# Altium schematic sheet FPGA核心板01.SchDoc
size A3
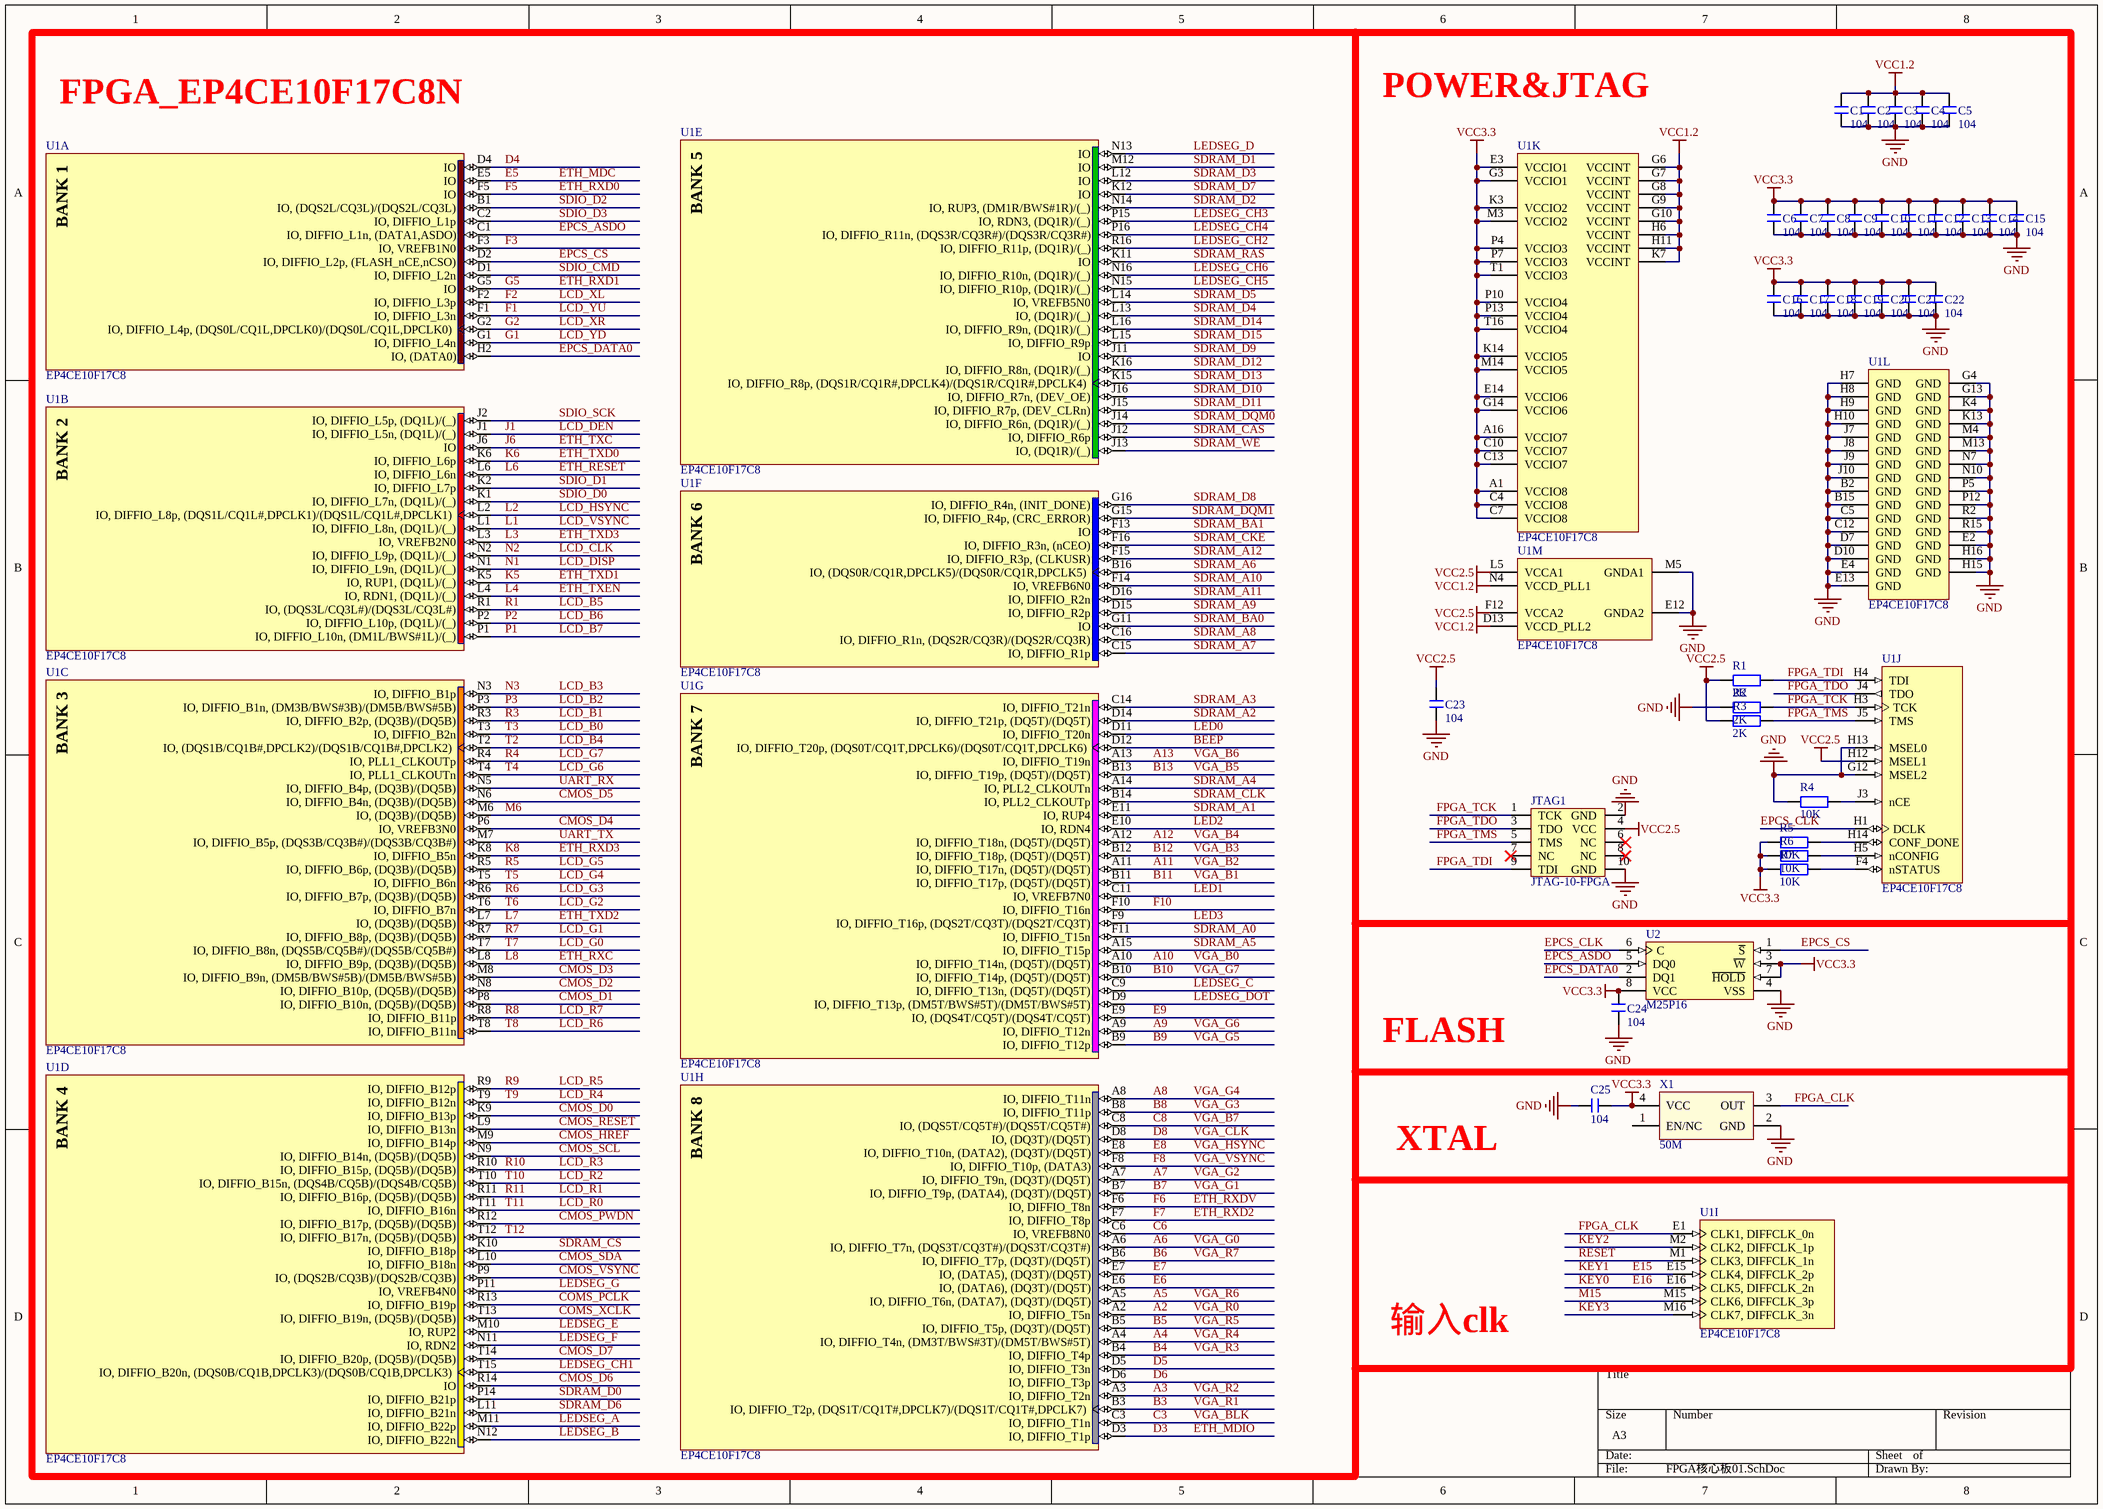
[diagram p0: FPGA核心板01.SchDoc]

## Parts
C1  104  [C 0603_L]
C2  104  [C 0603_L]
C3  104  [C 0603_L]
C4  104  [C 0603_L]
C5  104  [C 0603_L]
C6  104  [C 0603_L]
C7  104  [C 0603_L]
C8  104  [C 0603_L]
C9  104  [C 0603_L]
C10  104  [C 0603_L]
C11  104  [C 0603_L]
C12  104  [C 0603_L]
C13  104  [C 0603_L]
C14  104  [C 0603_L]
C15  104  [C 0603_L]
C16  104  [C 0603_L]
C17  104  [C 0603_L]
C18  104  [C 0603_L]
C19  104  [C 0603_L]
C20  104  [C 0603_L]
C21  104  [C 0603_L]
C22  104  [C 0603_L]
C23  104  [C 0603_L]
C24  104  [C 0603_L]
C25  104  [C 0603_L]
JTAG1  JTAG-10-FPGA  [JTAG_10_2.54]
R1  2K  [R 0603_L]
R2  2K  [R 0603_L]
R3  2K  [R 0603_L]
R4  10K  [R 0603_L]
R5  10K  [R 0603_L]
R6  10K  [R 0603_L]
R7  10K  [R 0603_L]
U1  EP4CE10F17C8  [FBGA256]  (parts A,B,C,D,E,F,G,H,I,J,K,L,M of 13)
U2  M25P16  [sop-8]
X1  50M  [OSC 3225-4P]

## Nets
GND: C1.1 C2.1 C3.1 C4.1 C5.1 C6.1 C7.1 C8.1 C9.1 C10.1 C11.1 C12.1 C13.1 C14.1 C15.1 C16.1 C17.1 C18.1 C19.1 C20.1 C21.1 C22.1 C23.1 C24.1 C25.2 JTAG1.2(GND) JTAG1.10(GND) R2.1 R4.1 U1.B2(GND) U1.B15(GND) U1.C5(GND) U1.C12(GND) U1.D7(GND) U1.D10(GND) U1.E2(GND) U1.E4(GND) U1.E12(GNDA2) U1.E13(GND) U1.G4(GND) U1.G12(MSEL2) U1.G13(GND) U1.H7(GND) U1.H8(GND) U1.H9(GND) U1.H10(GND) U1.H13(MSEL0) U1.H15(GND) U1.H16(GND) U1.J7(GND) U1.J8(GND) U1.J9(GND) U1.J10(GND) U1.K4(GND) U1.K13(GND) U1.M4(GND) U1.M5(GNDA1) U1.M13(GND) U1.N7(GND) U1.N10(GND) U1.P5(GND) U1.P12(GND) U1.R2(GND) U1.R15(GND) U2.4(VSS) X1.2(GND)
VCC1.2: C1.2 C2.2 C3.2 C4.2 C5.2 U1.D13(VCCD_PLL2) U1.G6(VCCINT) U1.G7(VCCINT) U1.G8(VCCINT) U1.G9(VCCINT) U1.G10(VCCINT) U1.H6(VCCINT) U1.H11(VCCINT) U1.K7(VCCINT) U1.N4(VCCD_PLL1)
VCC2.5: C23.2 JTAG1.4(VCC) R1.1 R3.1 U1.F12(VCCA2) U1.H12(MSEL1) U1.L5(VCCA1)
VCC3.3: C6.2 C7.2 C8.2 C9.2 C10.2 C11.2 C12.2 C13.2 C14.2 C15.2 C16.2 C17.2 C18.2 C19.2 C20.2 C21.2 C22.2 C24.2 C25.1 R5.1 R6.1 R7.1 U1.A1(VCCIO8) U1.A16(VCCIO7) U1.C4(VCCIO8) U1.C7(VCCIO8) U1.C10(VCCIO7) U1.C13(VCCIO7) U1.E3(VCCIO1) U1.E14(VCCIO6) U1.G3(VCCIO1) U1.G14(VCCIO6) U1.K3(VCCIO2) U1.K14(VCCIO5) U1.M3(VCCIO2) U1.M14(VCCIO5) U1.P4(VCCIO3) U1.P7(VCCIO3) U1.P10(VCCIO4) U1.P13(VCCIO4) U1.T1(VCCIO3) U1.T16(VCCIO4) U2.3(~{W}) U2.7(~{HOLD}) U2.8(VCC) X1.4(VCC)
A2: U1.A2(IO,_DIFFIO_T5n)  [also labelled VGA_R0]
A3: U1.A3(IO,_DIFFIO_T2n)  [also labelled VGA_R2]
A4: U1.A4(IO,_DIFFIO_T4n,_(DM3T/BWS#3T)/(DM5T/BWS#5T))  [also labelled VGA_R4]
A5: U1.A5(IO,_DIFFIO_T6n,_(DATA7),_(DQ3T)/(DQ5T))  [also labelled VGA_R6]
A6: U1.A6(IO,_DIFFIO_T7n,_(DQS3T/CQ3T#)/(DQS3T/CQ3T#))  [also labelled VGA_G0]
A7: U1.A7(IO,_DIFFIO_T9n,_(DQ3T)/(DQ5T))  [also labelled VGA_G2]
A8: U1.A8(IO,_DIFFIO_T11n)  [also labelled VGA_G4]
A9: U1.A9(IO,_DIFFIO_T12n)  [also labelled VGA_G6]
A10: U1.A10(IO,_DIFFIO_T14n,_(DQ5T)/(DQ5T))  [also labelled VGA_B0]
A11: U1.A11(IO,_DIFFIO_T17n,_(DQ5T)/(DQ5T))  [also labelled VGA_B2]
A12: U1.A12(IO,_DIFFIO_T18n,_(DQ5T)/(DQ5T))  [also labelled VGA_B4]
A13: U1.A13(IO,_DIFFIO_T19n)  [also labelled VGA_B6]
B3: U1.B3(IO,_DIFFIO_T2p,_(DQS1T/CQ1T#,DPCLK7)/(DQS1T/CQ1T#,DPCLK7))  [also labelled VGA_R1]
B4: U1.B4(IO,_DIFFIO_T4p)  [also labelled VGA_R3]
B5: U1.B5(IO,_DIFFIO_T5p,_(DQ3T)/(DQ5T))  [also labelled VGA_R5]
B6: U1.B6(IO,_DIFFIO_T7p,_(DQ3T)/(DQ5T))  [also labelled VGA_R7]
B7: U1.B7(IO,_DIFFIO_T9p,_(DATA4),_(DQ3T)/(DQ5T))  [also labelled VGA_G1]
B8: U1.B8(IO,_DIFFIO_T11p)  [also labelled VGA_G3]
B9: U1.B9(IO,_DIFFIO_T12p)  [also labelled VGA_G5]
B10: U1.B10(IO,_DIFFIO_T14p,_(DQ5T)/(DQ5T))  [also labelled VGA_G7]
B11: U1.B11(IO,_DIFFIO_T17p,_(DQ5T)/(DQ5T))  [also labelled VGA_B1]
B12: U1.B12(IO,_DIFFIO_T18p,_(DQ5T)/(DQ5T))  [also labelled VGA_B3]
B13: U1.B13(IO,_DIFFIO_T19p,_(DQ5T)/(DQ5T))  [also labelled VGA_B5]
BEEP: U1.D12(IO,_DIFFIO_T20p,_(DQS0T/CQ1T,DPCLK6)/(DQS0T/CQ1T,DPCLK6))
C3: U1.C3(IO,_DIFFIO_T1n)  [also labelled VGA_BLK]
C6: U1.C6(IO,_VREFB8N0)
C8: U1.C8(IO,_(DQS5T/CQ5T#)/(DQS5T/CQ5T#))  [also labelled VGA_B7]
CMOS_D0: U1.K9(IO,_DIFFIO_B13p)
CMOS_D1: U1.P8(IO,_DIFFIO_B10n,_(DQ5B)/(DQ5B))
CMOS_D2: U1.N8(IO,_DIFFIO_B10p,_(DQ5B)/(DQ5B))
CMOS_D3: U1.M8(IO,_DIFFIO_B9n,_(DM5B/BWS#5B)/(DM5B/BWS#5B))
CMOS_D4: U1.P6(IO,_VREFB3N0)
CMOS_D5: U1.N6(IO,_DIFFIO_B4n,_(DQ3B)/(DQ5B))
CMOS_D6: U1.R14(IO)
CMOS_D7: U1.T14(IO,_DIFFIO_B20p,_(DQ5B)/(DQ5B))
CMOS_HREF: U1.M9(IO,_DIFFIO_B14p)
CMOS_PWDN: U1.R12(IO,_DIFFIO_B17p,_(DQ5B)/(DQ5B))
CMOS_RESET: U1.L9(IO,_DIFFIO_B13n)
CMOS_SCL: U1.N9(IO,_DIFFIO_B14n,_(DQ5B)/(DQ5B))
CMOS_SDA: U1.L10(IO,_DIFFIO_B18n)
CMOS_VSYNC: U1.P9(IO,_(DQS2B/CQ3B)/(DQS2B/CQ3B))
COMS_PCLK: U1.R13(IO,_DIFFIO_B19p)
COMS_XCLK: U1.T13(IO,_DIFFIO_B19n,_(DQ5B)/(DQ5B))
D3: U1.D3(IO,_DIFFIO_T1p)  [also labelled ETH_MDIO]
D4: U1.D4(IO)
D5: U1.D5(IO,_DIFFIO_T3n)
D6: U1.D6(IO,_DIFFIO_T3p)
D8: U1.D8(IO,_(DQ3T)/(DQ5T))  [also labelled VGA_CLK]
E5: U1.E5(IO)  [also labelled ETH_MDC]
E6: U1.E6(IO,_(DATA6),_(DQ3T)/(DQ5T))
E7: U1.E7(IO,_(DATA5),_(DQ3T)/(DQ5T))
E8: U1.E8(IO,_DIFFIO_T10n,_(DATA2),_(DQ3T)/(DQ5T))  [also labelled VGA_HSYNC]
E9: U1.E9(IO,_(DQS4T/CQ5T)/(DQS4T/CQ5T))
E15: U1.E15(CLK4,_DIFFCLK_2p)  [also labelled KEY1]
E16: U1.E16(CLK5,_DIFFCLK_2n)  [also labelled KEY0]
EPCS_ASDO: U1.C1(IO,_DIFFIO_L1n,_(DATA1,ASDO)) U2.5(DQ0)
EPCS_CLK: U1.H1(DCLK) U2.6(C)
EPCS_CS: U1.D2(IO,_DIFFIO_L2p,_(FLASH_nCE,nCSO)) U2.1(~{S})
EPCS_DATA0: U1.H2(IO,_(DATA0)) U2.2(DQ1)
ETH_RESET: U1.L6(IO,_DIFFIO_L6n)  [also labelled L6]
ETH_RXC: U1.L8(IO,_DIFFIO_B9p,_(DQ3B)/(DQ5B))  [also labelled L8]
ETH_RXD0: U1.F5(IO)  [also labelled F5]
ETH_RXD1: U1.G5(IO)  [also labelled G5]
ETH_RXD2: U1.F7(IO,_DIFFIO_T8p)  [also labelled F7]
ETH_RXD3: U1.K8(IO,_DIFFIO_B5n)  [also labelled K8]
ETH_RXDV: U1.F6(IO,_DIFFIO_T8n)  [also labelled F6]
ETH_TXC: U1.J6(IO)  [also labelled J6]
ETH_TXD0: U1.K6(IO,_DIFFIO_L6p)  [also labelled K6]
ETH_TXD1: U1.K5(IO,_RUP1,_(DQ1L)/(_))  [also labelled K5]
ETH_TXD2: U1.L7(IO,_(DQ3B)/(DQ5B))  [also labelled L7]
ETH_TXD3: U1.L3(IO,_VREFB2N0)  [also labelled L3]
ETH_TXEN: U1.L4(IO,_RDN1,_(DQ1L)/(_))  [also labelled L4]
F1: U1.F1(IO,_DIFFIO_L3n)  [also labelled LCD_YU]
F2: U1.F2(IO,_DIFFIO_L3p)  [also labelled LCD_XL]
F3: U1.F3(IO,_VREFB1N0)
F8: U1.F8(IO,_DIFFIO_T10p,_(DATA3))  [also labelled VGA_VSYNC]
F10: U1.F10(IO,_DIFFIO_T16n)
FPGA_CLK: U1.E1(CLK1,_DIFFCLK_0n) X1.3(OUT)
FPGA_TCK: JTAG1.1(TCK) R2.2 U1.H3(TCK)
FPGA_TDI: JTAG1.9(TDI) R1.2 U1.H4(TDI)
FPGA_TDO: JTAG1.3(TDO) U1.J4(TDO)
FPGA_TMS: JTAG1.5(TMS) R3.2 U1.J5(TMS)
G1: U1.G1(IO,_DIFFIO_L4n)  [also labelled LCD_YD]
G2: U1.G2(IO,_DIFFIO_L4p,_(DQS0L/CQ1L,DPCLK0)/(DQS0L/CQ1L,DPCLK0))  [also labelled LCD_XR]
J1: U1.J1(IO,_DIFFIO_L5n,_(DQ1L)/(_))  [also labelled LCD_DEN]
KEY2: U1.M2(CLK2,_DIFFCLK_1p)
KEY3: U1.M16(CLK7,_DIFFCLK_3n)
L1: U1.L1(IO,_DIFFIO_L8n,_(DQ1L)/(_))  [also labelled LCD_VSYNC]
L2: U1.L2(IO,_DIFFIO_L8p,_(DQS1L/CQ1L#,DPCLK1)/(DQS1L/CQ1L#,DPCLK1))  [also labelled LCD_HSYNC]
LCD_B0: U1.T3(IO,_DIFFIO_B2n)  [also labelled T3]
LCD_B1: U1.R3(IO,_DIFFIO_B2p,_(DQ3B)/(DQ5B))  [also labelled R3]
LCD_B2: U1.P3(IO,_DIFFIO_B1n,_(DM3B/BWS#3B)/(DM5B/BWS#5B))  [also labelled P3]
LCD_B3: U1.N3(IO,_DIFFIO_B1p)  [also labelled N3]
LCD_B4: U1.T2(IO,_(DQS1B/CQ1B#,DPCLK2)/(DQS1B/CQ1B#,DPCLK2))  [also labelled T2]
LCD_B5: U1.R1(IO,_(DQS3L/CQ3L#)/(DQS3L/CQ3L#))  [also labelled R1]
LCD_B6: U1.P2(IO,_DIFFIO_L10p,_(DQ1L)/(_))  [also labelled P2]
LCD_B7: U1.P1(IO,_DIFFIO_L10n,_(DM1L/BWS#1L)/(_))  [also labelled P1]
LCD_CLK: U1.N2(IO,_DIFFIO_L9p,_(DQ1L)/(_))  [also labelled N2]
LCD_DISP: U1.N1(IO,_DIFFIO_L9n,_(DQ1L)/(_))  [also labelled N1]
LCD_G0: U1.T7(IO,_DIFFIO_B8n,_(DQS5B/CQ5B#)/(DQS5B/CQ5B#))  [also labelled T7]
LCD_G1: U1.R7(IO,_DIFFIO_B8p,_(DQ3B)/(DQ5B))  [also labelled R7]
LCD_G2: U1.T6(IO,_DIFFIO_B7n)  [also labelled T6]
LCD_G3: U1.R6(IO,_DIFFIO_B7p,_(DQ3B)/(DQ5B))  [also labelled R6]
LCD_G4: U1.T5(IO,_DIFFIO_B6n)  [also labelled T5]
LCD_G5: U1.R5(IO,_DIFFIO_B6p,_(DQ3B)/(DQ5B))  [also labelled R5]
LCD_G6: U1.T4(IO,_PLL1_CLKOUTn)  [also labelled T4]
LCD_G7: U1.R4(IO,_PLL1_CLKOUTp)  [also labelled R4]
LCD_R0: U1.T11(IO,_DIFFIO_B16n)  [also labelled T11]
LCD_R1: U1.R11(IO,_DIFFIO_B16p,_(DQ5B)/(DQ5B))  [also labelled R11]
LCD_R2: U1.T10(IO,_DIFFIO_B15n,_(DQS4B/CQ5B)/(DQS4B/CQ5B))  [also labelled T10]
LCD_R3: U1.R10(IO,_DIFFIO_B15p,_(DQ5B)/(DQ5B))  [also labelled R10]
LCD_R4: U1.T9(IO,_DIFFIO_B12n)  [also labelled T9]
LCD_R5: U1.R9(IO,_DIFFIO_B12p)  [also labelled R9]
LCD_R6: U1.T8(IO,_DIFFIO_B11n)  [also labelled T8]
LCD_R7: U1.R8(IO,_DIFFIO_B11p)  [also labelled R8]
LED0: U1.D11(IO,_DIFFIO_T20n)
LED1: U1.C11(IO,_VREFB7N0)
LED2: U1.E10(IO,_RDN4)
LED3: U1.F9(IO,_DIFFIO_T16p,_(DQS2T/CQ3T)/(DQS2T/CQ3T))
LEDSEG_A: U1.M11(IO,_DIFFIO_B22p)
LEDSEG_B: U1.N12(IO,_DIFFIO_B22n)
LEDSEG_C: U1.C9(IO,_DIFFIO_T13n,_(DQ5T)/(DQ5T))
LEDSEG_CH1: U1.T15(IO,_DIFFIO_B20n,_(DQS0B/CQ1B,DPCLK3)/(DQS0B/CQ1B,DPCLK3))
LEDSEG_CH2: U1.R16(IO,_DIFFIO_R11p,_(DQ1R)/(_))
LEDSEG_CH3: U1.P15(IO,_RDN3,_(DQ1R)/(_))
LEDSEG_CH4: U1.P16(IO,_DIFFIO_R11n,_(DQS3R/CQ3R#)/(DQS3R/CQ3R#))
LEDSEG_CH5: U1.N15(IO,_DIFFIO_R10p,_(DQ1R)/(_))
LEDSEG_CH6: U1.N16(IO,_DIFFIO_R10n,_(DQ1R)/(_))
LEDSEG_D: U1.N13(IO)
LEDSEG_DOT: U1.D9(IO,_DIFFIO_T13p,_(DM5T/BWS#5T)/(DM5T/BWS#5T))
LEDSEG_E: U1.M10(IO,_RUP2)
LEDSEG_F: U1.N11(IO,_RDN2)
LEDSEG_G: U1.P11(IO,_VREFB4N0)
M6: U1.M6(IO,_(DQ3B)/(DQ5B))
M15: U1.M15(CLK6,_DIFFCLK_3p)
RESET: U1.M1(CLK3,_DIFFCLK_1n)
SDIO_CMD: U1.D1(IO,_DIFFIO_L2n)
SDIO_D0: U1.K1(IO,_DIFFIO_L7n,_(DQ1L)/(_))
SDIO_D1: U1.K2(IO,_DIFFIO_L7p)
SDIO_D2: U1.B1(IO,_(DQS2L/CQ3L)/(DQS2L/CQ3L))
SDIO_D3: U1.C2(IO,_DIFFIO_L1p)
SDIO_SCK: U1.J2(IO,_DIFFIO_L5p,_(DQ1L)/(_))
SDRAM_A0: U1.F11(IO,_DIFFIO_T15n)
SDRAM_A1: U1.E11(IO,_RUP4)
SDRAM_A2: U1.D14(IO,_DIFFIO_T21p,_(DQ5T)/(DQ5T))
SDRAM_A3: U1.C14(IO,_DIFFIO_T21n)
SDRAM_A4: U1.A14(IO,_PLL2_CLKOUTn)
SDRAM_A5: U1.A15(IO,_DIFFIO_T15p)
SDRAM_A6: U1.B16(IO,_(DQS0R/CQ1R,DPCLK5)/(DQS0R/CQ1R,DPCLK5))
SDRAM_A7: U1.C15(IO,_DIFFIO_R1p)
SDRAM_A8: U1.C16(IO,_DIFFIO_R1n,_(DQS2R/CQ3R)/(DQS2R/CQ3R))
SDRAM_A9: U1.D15(IO,_DIFFIO_R2p)
SDRAM_A10: U1.F14(IO,_VREFB6N0)
SDRAM_A11: U1.D16(IO,_DIFFIO_R2n)
SDRAM_A12: U1.F15(IO,_DIFFIO_R3p,_(CLKUSR))
SDRAM_BA0: U1.G11(IO)
SDRAM_BA1: U1.F13(IO)
SDRAM_CAS: U1.J12(IO,_DIFFIO_R6p)
SDRAM_CKE: U1.F16(IO,_DIFFIO_R3n,_(nCEO))
SDRAM_CLK: U1.B14(IO,_PLL2_CLKOUTp)
SDRAM_CS: U1.K10(IO,_DIFFIO_B18p)
SDRAM_D0: U1.P14(IO,_DIFFIO_B21p)
SDRAM_D1: U1.M12(IO)
SDRAM_D2: U1.N14(IO,_RUP3,_(DM1R/BWS#1R)/(_))
SDRAM_D3: U1.L12(IO)
SDRAM_D4: U1.L13(IO,_(DQ1R)/(_))
SDRAM_D5: U1.L14(IO,_VREFB5N0)
SDRAM_D6: U1.L11(IO,_DIFFIO_B21n)
SDRAM_D7: U1.K12(IO)
SDRAM_D8: U1.G16(IO,_DIFFIO_R4n,_(INIT_DONE))
SDRAM_D9: U1.J11(IO)
SDRAM_D10: U1.J16(IO,_DIFFIO_R7n,_(DEV_OE))
SDRAM_D11: U1.J15(IO,_DIFFIO_R7p,_(DEV_CLRn))
SDRAM_D12: U1.K16(IO,_DIFFIO_R8n,_(DQ1R)/(_))
SDRAM_D13: U1.K15(IO,_DIFFIO_R8p,_(DQS1R/CQ1R#,DPCLK4)/(DQS1R/CQ1R#,DPCLK4))
SDRAM_D14: U1.L16(IO,_DIFFIO_R9n,_(DQ1R)/(_))
SDRAM_D15: U1.L15(IO,_DIFFIO_R9p)
SDRAM_DQM0: U1.J14(IO,_DIFFIO_R6n,_(DQ1R)/(_))
SDRAM_DQM1: U1.G15(IO,_DIFFIO_R4p,_(CRC_ERROR))
SDRAM_RAS: U1.K11(IO)
SDRAM_WE: U1.J13(IO,_(DQ1R)/(_))
T12: U1.T12(IO,_DIFFIO_B17n,_(DQ5B)/(DQ5B))
UART_RX: U1.N5(IO,_DIFFIO_B4p,_(DQ3B)/(DQ5B))
UART_TX: U1.M7(IO,_DIFFIO_B5p,_(DQS3B/CQ3B#)/(DQS3B/CQ3B#))
NetR4_2: R4.2 U1.J3(nCE)
NetR5_2: R5.2 U1.H14(CONF_DONE)
NetR6_2: R6.2 U1.H5(nCONFIG)
NetR7_2: R7.2 U1.F4(nSTATUS)

Not connected (* = marked no-connect by the designer): JTAG1 6(NC)* 7(NC)* 8(NC)*; X1 1(EN/NC)

## Notes on the sheet
- FPGA_EP4CE10F17C8N
- POWER&JTAG
- FLASH
- XTAL
- 输入clk
- (in symbol EP4CE6F17C8, part A) BANK 1
- (in symbol EP4CE6F17C8, part B) BANK 2
- (in symbol EP4CE6F17C8, part C) BANK 3
- (in symbol EP4CE6F17C8, part D) BANK 4
- (in symbol EP4CE6F17C8, part E) BANK 5
- (in symbol EP4CE6F17C8, part F) BANK 6
- (in symbol EP4CE6F17C8, part G) BANK 7
- (in symbol EP4CE6F17C8, part H) BANK 8

## Library data of the parts
C1-C25 = C: 贴片电容; BOM名称: 无极性贴片电容; 淘宝ID: 封装库来自淘宝 ID：黄晶宝石; 联系售后: https://shop463601444.taobao.com
R1-R7 = R: 贴片电阻; 版权归属: 来自淘宝 ID：黄晶宝石; BOM名称: 贴片电阻; 联系售后: https://shop463601444.taobao.com
U1 = EP4CE6F17C8: Cyclone IV Family FPGA, 2V Core, 179 I/O Pins, 2 PLLs, 256-Pin FBGA, Speed Grade 8, Commercial Grade; Published: 3-May-2010; DatasheetVersion: ver1.2, Mar-2010; PackageVersion: ver16.0, Dec-2009; PackageReference: FBGA256; Publisher: Altium Limited; PackageDescription: 256-Ball FineLine Ball Grid Array (FBGA256) - Option 1 - Wire Bond; Supplier 1: Digi-Key; Supplier Part Number 1: EP4CE6F17C8-ND; Code_JEDEC: MS-034-AAF-1; Code_IPC: BGA100P16X16-256; ComponentLink1Description: Manufacturer Link; ComponentLink1URL: http://www.altera.com/; ComponentLink2Description: Handbook; ComponentLink2URL: http://www.altera.com/literature/hb/cyclone-iv/cyclone4-handbook.pdf; ComponentLink3Description: Pinout Specification; ComponentLink3URL: http://www.altera.com/literature/lit-dp.jsp?category=cyc%204&showspreadsheet=y; ComponentLink4Description: Packaging Specification; ComponentLink4URL: http://www.altera.com/literature/ds/dspkg.pdf
U2 = M25P16: 16 Mb (x1) Automotive Serial NOR Flash Memory, 75 MHz, 2.7 to 3.6 V, 8-pin SO8; Part Family: M25P爭ISHIDDEN=T|; Manufacturer: Micron; PartNumber: M25P16-VMN3PB; Density: 16Mb爭ISHIDDEN=T|; Speed: 75 MHz爭ISHIDDEN=T|; Voltage: 2.7V-3.6V爭ISHIDDEN=T|; DatasheetVersion: Rev. Y; PackageVersion: Rev 11; PackageReference: MICT-MN-8; PackageDescription: 8-Pin SO Narrow, 3.9 X 4.9 mm, Pitch 1.27 mm; Applications: Automotive爭ISHIDDEN=T|; Package: SO8 Narrow爭ISHIDDEN=T|; Part Status: Production爭ISHIDDEN=T|; RoHS: Yes爭ISHIDDEN=T|; Type: Data Storage爭ISHIDDEN=T|; Width: x1爭ISHIDDEN=T|; Mounting Technology: Surface Mount; ComponentLink1Description: Manufacturer URL; ComponentLink1URL: http://www.micron.com/; ComponentLink2Description: Datasheet; ComponentLink2URL: http://www.micron.com/~/media/Documents/Products/Data%20Sheet/NOR%20Flash/Serial%20NOR/M25P/M25P16.pdf; ComponentLink3Description: Package Specification; ComponentLink3URL: http://www.micron.com/~/media/Documents/Products/Data%20Sheet/NOR%20Flash/Serial%20NOR/M25P/M25P05A.pdf
X1 = XTAL-ACT-4P: 4脚有源晶振; 版权归属: 源创客; BOM名称: 4脚有源晶振; 学习资源: www.ooocke.com